# EAGLE design board (EAGLE 9.5.1)
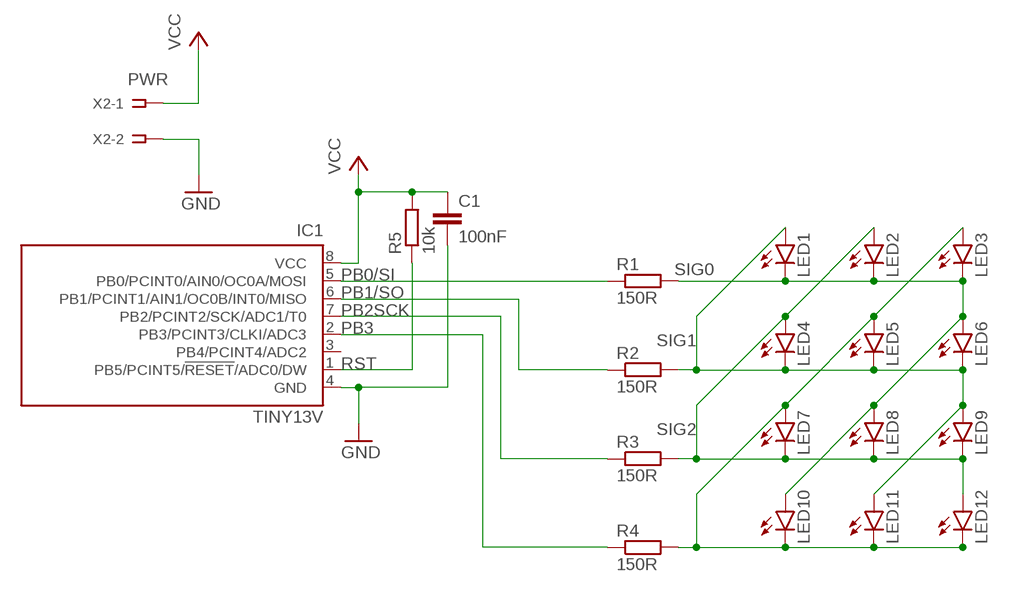
[diagram p0: schematic, sheet 1]

## Parts
C1  100nF  C-EUC1206K  [C1206K]
IC1  TINY13V  TINY13V-10SSU  [8S1]
LED1  LEDSFH480  [SFH480]
LED2  LEDSFH480  [SFH480]
LED3  LEDSFH480  [SFH480]
LED4  LEDSFH480  [SFH480]
LED5  LEDSFH480  [SFH480]
LED6  LEDSFH480  [SFH480]
LED7  LEDSFH480  [SFH480]
LED8  LEDSFH480  [SFH480]
LED9  LEDSFH480  [SFH480]
LED10  LEDSFH480  [SFH480]
LED11  LEDSFH480  [SFH480]
LED12  LEDSFH480  [SFH480]
R1  150R  R-EU_R1206  [R1206]
R2  150R  R-EU_R1206  [R1206]
R3  150R  R-EU_R1206  [R1206]
R4  150R  R-EU_R1206  [R1206]
R5  10k  R-EU_R1206  [R1206]
X2  PWR  SSW-101-02-G-D  [SSW-101-02-G-D]

## Nets
GND: C1.2 IC1.4(GND) X2.2
PB0/SI: IC1.5(PB0/PCINT0/AIN0/OC0A/MOSI) R1.1
PB1/SO: IC1.6(PB1/PCINT1/AIN1/OC0B/INT0/MISO) R2.1
PB2SCK: IC1.7(PB2/PCINT2/SCK/ADC1/T0) R3.1
PB3: IC1.2(PB3/PCINT3/CLKI/ADC3) R4.1
RST: IC1.1(PB5/PCINT5/!RESET!/ADC0/DW) R5.1
SIG0: LED1.K(C) LED2.K(C) LED3.K(C) LED6.A LED8.A LED10.A R1.2
SIG1: LED1.A LED4.K(C) LED5.K(C) LED6.K(C) LED9.A LED11.A R2.2
SIG2: LED2.A LED4.A LED7.K(C) LED8.K(C) LED9.K(C) LED12.A R3.2
SIG3: LED3.A LED5.A LED7.A LED10.K(C) LED11.K(C) LED12.K(C) R4.2
VCC: C1.1 IC1.8(VCC) R5.2 X2.1
Unconnected: IC1.3(PB4/PCINT4/ADC2)

## Library data of the parts
C1 = resistor:C-EU: CAPACITOR, European symbol
IC1 = atmel:TINY13: 8-bit AVR Microcontroller with 1K Bytes In-System Programmable Flash Source: http://www.atmel.com/dyn/resources/prod_documents/2535S.pdf; MPN: ATTINY13V-10SSU; OC_FARNELL: 1455135; OC_NEWARK: 58M3773
LED1-LED12 = led:LED: LED OSRAM: - CHIPLED LG R971, LG N971, LY N971, LG Q971, LY Q971, LO R971, LY R971 LH N974, LH R974 LS Q976, LO Q976, LY Q976 LO Q996 - Hyper CHIPLED LW Q18S LB Q993, LB Q99A, LB R99A - SideLED LS A670, LO A670, LY A670, LG A670, LP A670 LB A673, LV A673, LT A673, LW A673 LH A674 LY A675 LS A676, LA A676, LO A676, LY A676, LW A676 LS A679, LY A679, LG A679 - Hyper Micro SIDELED® LS Y876, LA Y876, LO Y876, LY Y876 LT Y87S - SmartLED LW L88C, LW L88S LB L89C, LB L89S, LG L890 LS L89K, LO L89K, LY L89K LS L896, LA L896, LO L896, LY L896 - TOPLED LS T670, LO T670, LY T670, LG T670, LP T670 LSG T670, LSP T670, LSY T670, LOP T670, LYG T670 LG T671, LOG T671, LSG T671 LB T673, LV T673, LT T673, LW T673 LH T674 LS T676, LA T676, LO T676, LY T676, LB T676, LH T676, LSB T676, LW T676 LB T67C, LV T67C, LT T67C, LS T67K, LO T67K, LY T67K, LW E67C LS E67B, LA E67B, LO E67B, LY E67B, LB E67C, LV E67C, LT E67C LW T67C LS T679, LY T679, LG T679 LS T770, LO T770, LY T770, LG T770, LP T770 LB T773, LV T773, LT T773, LW T773 LH T774 LS E675, LA E675, LY E675, LS T675 LS T776, LA T776, LO T776, LY T776, LB T776 LHGB T686 LT T68C, LB T68C - Hyper Mini TOPLED® LB M676 - Mini TOPLED Santana® LG M470 LS M47K, LO M47K, LY M47K Source: http://www.osram.convergy.de LUXEON: - LUMILED® LXK2-PW12-R00, LXK2-PW12-S00, LXK2-PW14-U00, LXK2-PW14-V00 LXK2-PM12-R00, LXK2-PM12-S00, LXK2-PM14-U00 LXK2-PE12-Q00, LXK2-PE12-R00, LXK2-PE12-S00, LXK2-PE14-T00, LXK2-PE14-U00 LXK2-PB12-K00, LXK2-PB12-L00, LXK2-PB12-M00, LXK2-PB14-N00, LXK2-PB14-P00, LXK2-PB14-Q00 LXK2-PR12-L00, LXK2-PR12-M00, LXK2-PR14-Q00, LXK2-PR14-R00 LXK2-PD12-Q00, LXK2-PD12-R00, LXK2-PD12-S00 LXK2-PH12-R00, LXK2-PH12-S00 LXK2-PL12-P00, LXK2-PL12-Q00, LXK2-PL12-R00 Source: www.luxeon.com KINGBRIGHT: KA-3528ASYC Source: www.kingbright.com
R1-R5 = rcl:R-EU_: RESISTOR, European symbol; SPICEPREFIX: R
X2 = con-samtec:SSW-101-02-G: THROUGH-HOLE .025" SQ POST SOCKET Source: Samtec SSW.pdf; MF: Samtec Inc.; MPN: SSW-101-02-G-D; OC_FARNELL: unknown; OC_NEWARK: 82P1456

## Board
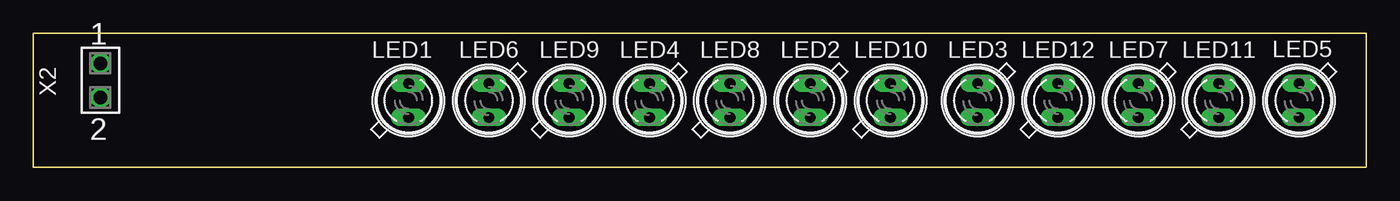
[diagram p1: board, top side]
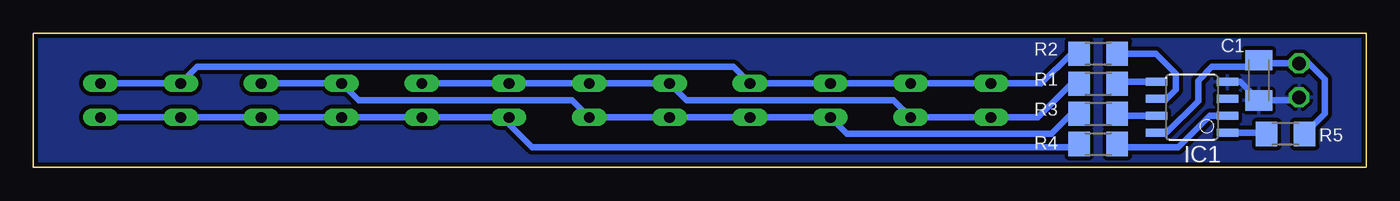
[diagram p2: board, bottom side, seen from below]

Size 99.5 x 10 mm. Coordinates in mm from the lower left corner, seen from the top.
Outline: 0,10 99.5,10 99.5,0 0,0 0,10
Copper layers (1*16): Top 0.035mm / dielectric 1.5mm / Bottom 0.035mm
Design rules "default *": minimum track width 6mil, minimum drill 0.35mm, track to track 6mil, track to pad 6mil, pad to pad 6mil, via to via 6mil, smd to smd 6mil, copper to edge 6mil, drill to drill 6mil, minimum pad ring 10mil, minimum via ring 8mil, stop-mask expansion 4mil, vias tented up to drill 0mil, thermal gap 10mil

### Footprints (pad centres in the part's own frame; a part is rotated, then mirrored left to right if it is on the bottom)
C1206K = smd 1.5 x 2: 1 -1.5,0; 2 1.5,0
8S1 = smd 0.6 x 1.6: 1 -1.905,-2.654; 2 -0.645,-2.654; 3 0.625,-2.654; 4 1.895,-2.654; 5 1.905,2.654; 6 0.635,2.654; 7 -0.635,2.654; 8 -1.905,2.654
SFH480 = drill 0.813 long: A 1.27,0; K -1.27,0
R1206 = smd 1.6 x 1.803: 1 -1.422,0; 2 1.422,0
SSW-101-02-G-D = drill 1 pad 1.5 octagon: 1 0,-1.27; 2 0,1.27

### Placement (x,y rotation side)
C1  8,6.5 270 bottom
IC1  13,4.5 90 bottom
LED1  28,5 90 top
LED2  58,5 270 top
LED3  70.5,5 270 top
LED4  46,5 270 top
LED5  94.5,5 270 top
LED6  34,5 270 top
LED7  82.5,5 270 top
LED8  52,5 90 top
LED9  40,5 90 top
LED10  64,5 90 top
LED11  88.5,5 90 top
LED12  76.5,5 90 top
R1  20,6.25 180 bottom
R2  20,8.5 180 bottom
R3  20,4 180 bottom
R4  20,1.75 180 bottom
R5  6,2.5 0 bottom
X2  5,6.5 180 top

### Tracks (layer width: path | path; a pad name or v marks a point on that pad's centre or on a via)
GND
  Bottom 0.5: 5.16,5.39 X2.2 5.23,5 C1.2 9.39,6.39 IC1.4
  pour Bottom (isolate 0.3): 0,10 99.5,10 99.5,0 0,0
PB0/SI
  Bottom 0.5: IC1.5 18.15,6.41 18.31,6.25 R1.1
PB1/SO
  Bottom 0.5: IC1.6 14.86,5.14 14.19,5.81 14.19,7 15.69,8.5 R2.1
PB2SCK
  Bottom 0.5: R3.1 18.44,3.86 IC1.7
PB3
  Bottom 0.5: IC1.2 11.64,3.86 14,1.5 18.33,1.5 R4.1
RST
  Bottom 0.5: R5.1 7.52,2.59 IC1.1
SIG0
  Bottom 0.5: LED3.K LED10.A LED2.K LED8.A 50.73,5 35.27,5 LED6.A LED1.K 24.52,3.73 22,6.25 R1.2
SIG1
  Bottom 0.5: LED5.K LED11.A 87.27,7.5 47.23,7.5 LED4.K LED9.A LED6.K LED1.A 24.23,6.27 22,8.5 R2.2
SIG2
  Bottom 0.5: LED7.K LED12.A 75.23,5 59.27,5 LED2.A LED8.K LED4.A LED9.K 38.77,2.5 23.5,2.5 22,4 R3.2
SIG3
  Bottom 0.5: R4.2 21.67,1.5 62.27,1.5 64.5,3.73 LED10.K LED3.A LED12.K LED7.A LED11.K LED5.A
VCC
  Bottom 0.5: 15.91,2.59 IC1.8 14.91,2.59 12.54,4.96 12.54,6.46 11.5,7.5 8.5,7.5 C1.1 | C1.1 | C1.1 7.5,8 7.27,7.77 X2.1 4.27,7.77 3.08,6.58 3.08,4 R5.2